# EAGLE design accel (EAGLE 5.09)
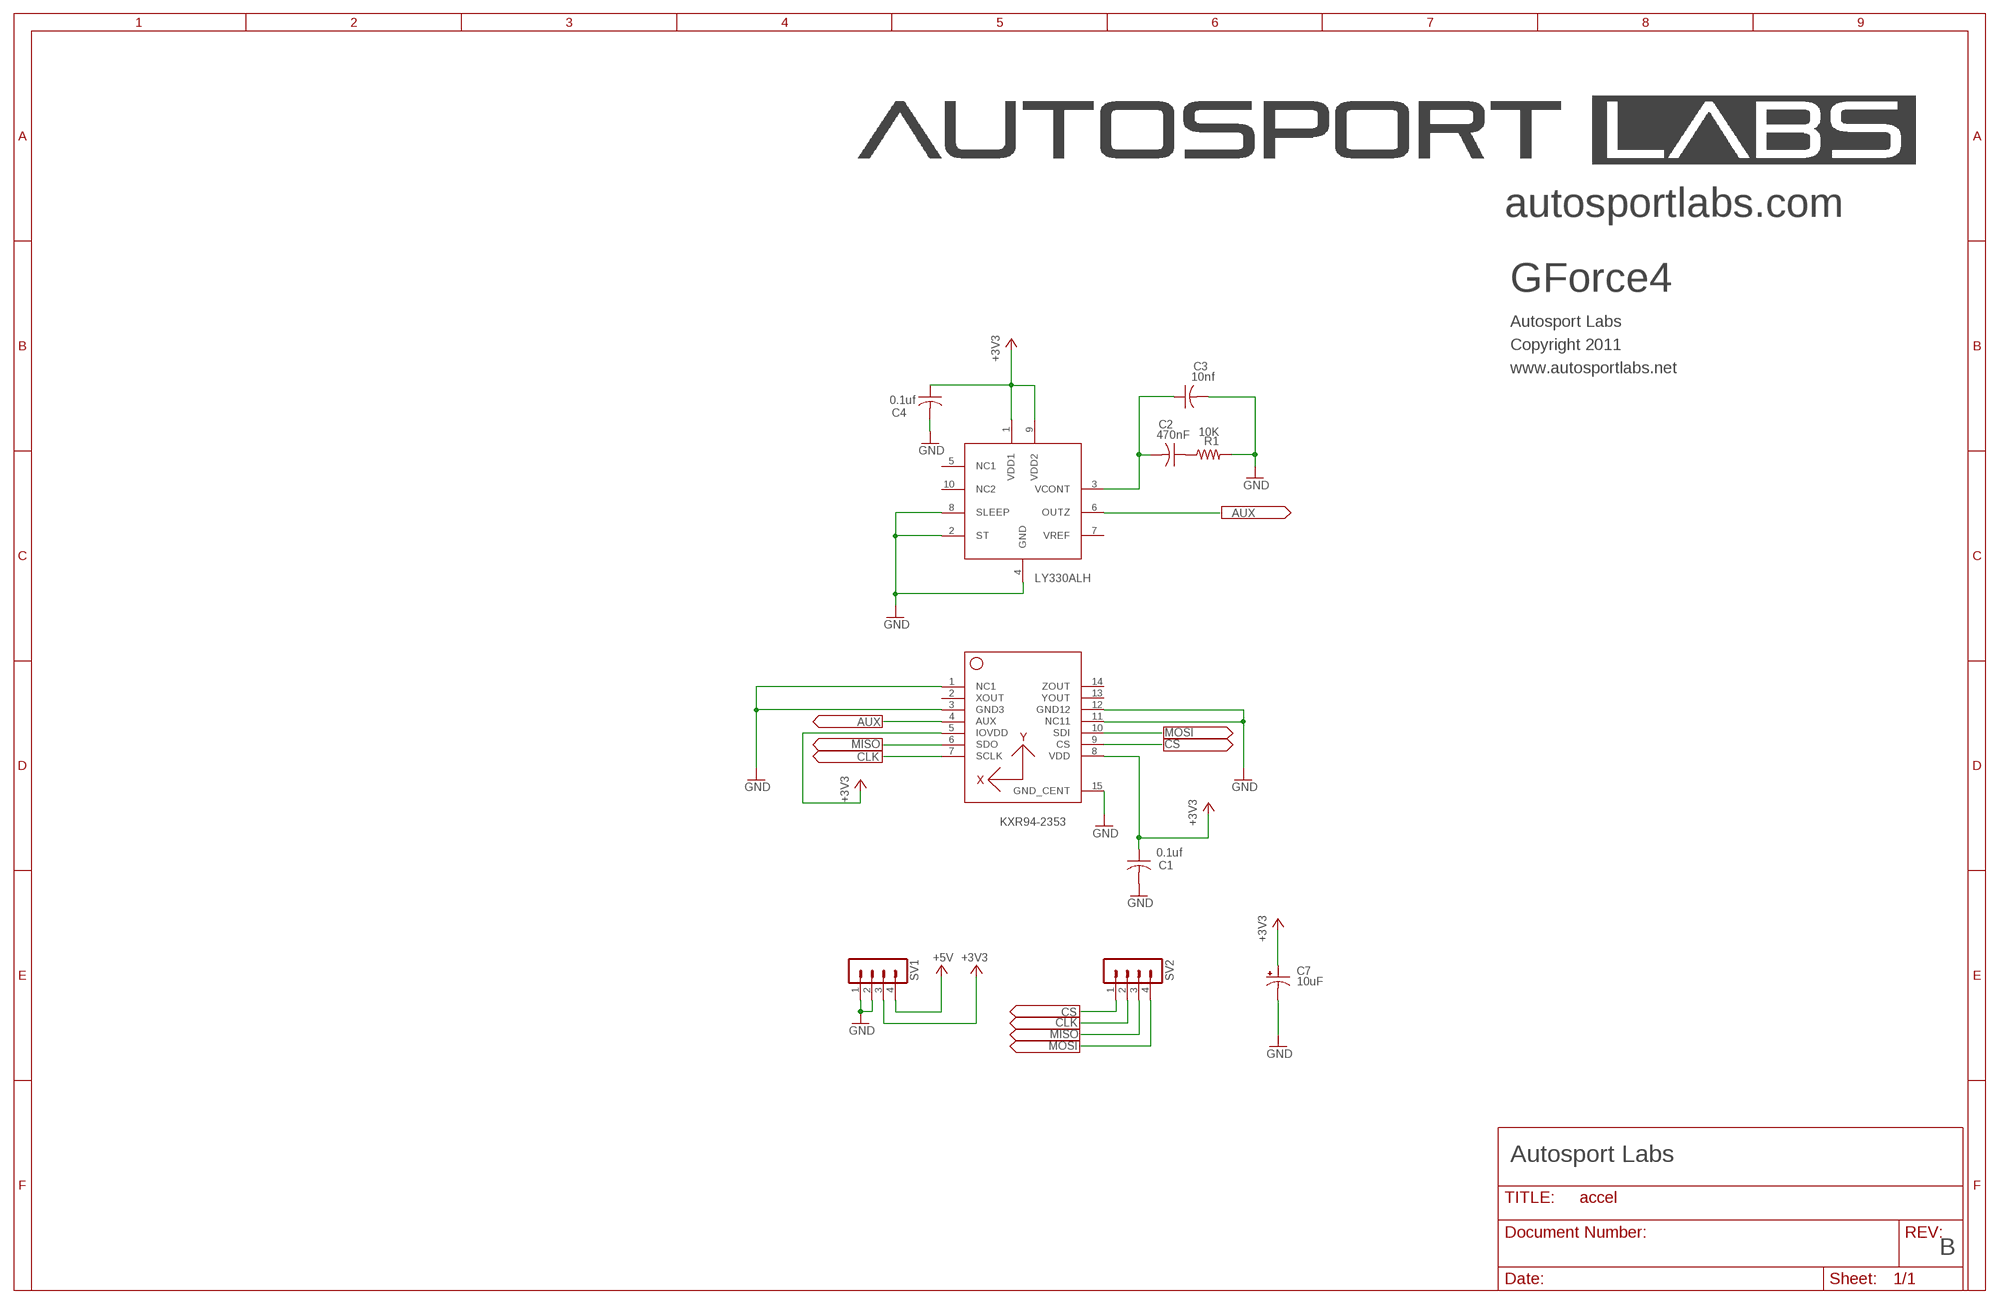
[diagram p0: schematic, sheet 1]

## Parts
C1  0.1uf  C-USC0603K  [C0603K]
C2  470nF  C-USC0603K  [C0603K]
C3  10nf  C-USC0603K  [C0603K]
C4  0.1uf  C-USC0603K  [C0603K]
C7  10uF  CPOL-USSMCA  [SMC_A]
R1  10K  R-US_R0603  [R0603]
SV1  MA04-1  [MA04-1]
SV2  MA04-1  [MA04-1]
U1  KXR94-2353  KXR94  [5X5_DFN]
U2  LY330ALH  [LGA-10]

## Nets
+3.3V: C1.1 C4.1 C7.+ SV1.3 U1.5(IOVDD) U1.8(VDD) U2.1(VDD1) U2.9(VDD2) ; supply symbol labelled +3V3
+5V: SV1.4
AUX: U1.4(AUX) U2.6(OUTZ)
CLK: SV2.2 U1.7(SCLK)
CS: SV2.1 U1.9(CS)
GND: C1.2 C3.2 C4.2 C7.- R1.2 SV1.1 SV1.2 U1.1(NC1) U1.3(GND3) U1.11(NC11) U1.12(GND12) U1.15(GND_CENT) U2.2(ST) U2.4(GND) U2.8(SLEEP)
MISO: SV2.3 U1.6(SDO)
MOSI: SV2.4 U1.10(SDI)
N$1: C2.1 R1.1
N$2: C2.2 C3.1 U2.3(VCONT)
Unconnected: U1.2(XOUT) U1.13(YOUT) U1.14(ZOUT) U2.5(NC1) U2.7(VREF) U2.10(NC2)

## Notes on the sheet
- autosportlabs.com
- GForce4
- Autosport Labs
- Copyright 2011
- www.autosportlabs.net
- LY330ALH
- KXR94-2353
- Autosport Labs
- B

## Library data of the parts
C1-C4 = rcl:C-US: CAPACITOR, American symbol
C7 = rcl:CPOL-US: POLARIZED CAPACITOR, American symbol
R1 = rcl:R-US_: RESISTOR, American symbol
SV1 SV2 = con-lstb:MA04-1: PIN HEADER
U1 = kionix:KXR94
U2 = ly330alh:LY330ALH

## Board
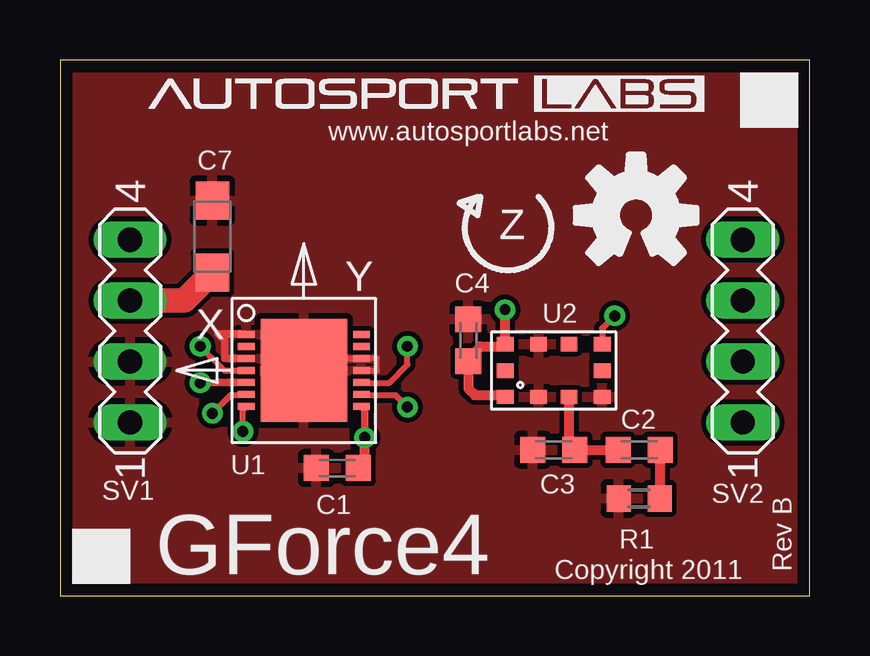
[diagram p1: board, top side]
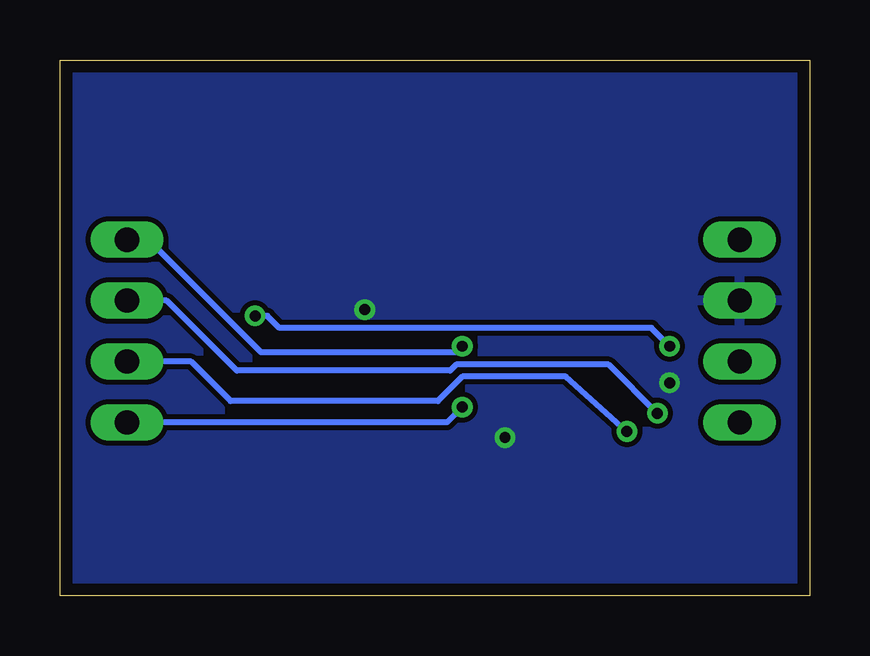
[diagram p2: board, bottom side, seen from below]

Size 31.24 x 22.35 mm. Coordinates in mm from the lower left corner, seen from the top.
Outline: 0,0 31.24,0 31.24,22.35 0,22.35 0,0
Copper layers (1*16): Top 0.035mm / dielectric 1.5mm / Bottom 0.035mm
Design rules "default *": minimum track width 10mil, minimum drill 16mil, track to track 8mil, track to pad 8mil, pad to pad 8mil, via to via 8mil, smd to smd 8mil, copper to edge 20mil, drill to drill 8mil, minimum pad ring 10mil, minimum via ring 8mil, stop-mask expansion 4mil, vias tented up to drill 0mil, thermal gap 10mil

### Footprints (pad centres in the part's own frame; a part is rotated, then mirrored left to right if it is on the bottom)
C0603K = smd 1.05 x 1.08: 1 -0.875,0; 2 0.875,0
SMC_A = smd 1.6 x 1.4: + -1.5,0; - 1.5,0
R0603 = smd 1 x 1.1: 1 -0.85,0; 2 0.85,0
MA04-1 = drill 1.016 long: 1 -3.81,0; 2 -1.27,0; 3 1.27,0; 4 3.81,0
5X5_DFN = smd 0.7 x 0.28: 1 -2.4,1.51; 2 -2.4,1.01; 3 -2.4,0.51; 4 -2.4,0.01; 5 -2.4,-0.49; 6 -2.4,-0.99; 7 -2.4,-1.49; 8 2.4,-1.49; 9 2.4,-0.99; 10 2.4,-0.49; 11 2.4,0.01; 12 2.4,0.51; 13 2.4,1.01; 14 2.4,1.51 | smd 3.6 x 4.3: 15 0,0
LGA-10 = smd 0.7 x 0.6: 1 -2.017,-1.1; 2 -0.635,-1.1; 3 0.635,-1.1; 4 2.017,-1.1; 5 2.017,0; 6 2.017,1.1; 7 0.635,1.1; 8 -0.635,1.1; 9 -2.017,1.1; 10 -2.017,0

### Placement (x,y rotation side)
C1  11.56,5.33 180 top
C2  24.13,6.1 180 top
C3  20.57,6.1 180 top
C4  17.02,10.67 90 top
C7  6.35,14.99 90 top
R1  24.13,4.06 180 top
SV1  2.92,11.05 90 top
SV2  28.45,11.05 90 top
U1  10.16,9.4 0 top
U2  20.57,9.4 0 top

### Tracks (layer width: path | path; a pad name or v marks a point on that pad's centre or on a via)
+3.3V  (via drill 0.46)
  Top 0.254: 12.7,7.77 U1.8
  Top 0.305: v12.7,6.6 12.7,7.77 | U1.5 6.62,8.91 v5.84,8.89
  Top 0.406: U2.1 18.47,8.38 17.27,8.38 17.02,8.64 C4.1 16.88,9.77 17.53,10.41 18.47,10.41 U2.9 18.54,10.51 v18.54,11.94 | v12.7,6.6 12.7,5.6 C1.1
  Top 1.016: SV1.3 5.18,12.32 C7.+
  pour Bottom: 0,22.35 31.24,22.35 31.24,0 0,0
+5V
  Bottom 0.813: SV1.4 3.53,14.86
  Bottom 1.016: 3.53,14.86 3.53,14.76
AUX  (via drill 0.46)
  Top 0.254: U2.6 22.59,11.16 v23.11,11.68 | v5.84,10.41 6.86,9.4 7.75,9.4 U1.4
  Bottom 0.254: 5.84,10.16 v5.84,10.41 6.6,11.18 22.1,11.18 22.61,11.68 v23.11,11.68
CLK  (via drill 0.46)
  Top 0.254: v7.62,6.86 7.62,7.77 U1.7
  Bottom 0.254: SV2.2 25.78,9.78 24.13,8.13 15.49,8.13 14.48,9.14 10.16,9.14 v7.62,6.86
CS  (via drill 0.46)
  Top 0.254: U1.9 12.59,8.38 13.97,8.38 v14.48,7.87
  Bottom 0.254: SV2.1 15.11,7.24 v14.48,7.87
GND
  Top 0.254: U1.11 13.2,9.41 13.21,9.4 13.21,9.91 12.45,9.91 | U1.15 10.67,9.91 U1.12
  Top 0.305: U1.3 6.86,9.91 6.86,10.67 6.6,10.92 7.75,10.92 U1.1
  pour Top: 0,22.35 0,0 31.24,0 31.24,22.35
MISO  (via drill 0.46)
  Top 0.254: v6.35,7.62 7.11,8.38 7.73,8.38 U1.6
  Bottom 0.254: SV2.3 26.8,12.32 23.88,9.4 14.99,9.4 14.73,9.65 8.38,9.65 v6.35,7.62
MOSI  (via drill 0.46)
  Top 0.254: U1.10 12.58,8.89 13.72,8.89 14.48,9.65 v14.48,10.41
  Bottom 0.254: SV2.4 27.56,14.86 22.86,10.16 14.73,10.16 v14.48,10.41
N$1
  Top 0.406: R1.1 25,4.06 C2.1
N$2
  Top 0.406: U2.3 21.21,6.1 C3.1 C2.2

### Text on the board
tPlace: www.autosportlabs.net | Z | GForce4 | Copyright 2011 | Rev B